# EAGLE design segaaudio (EAGLE 7.7.0)
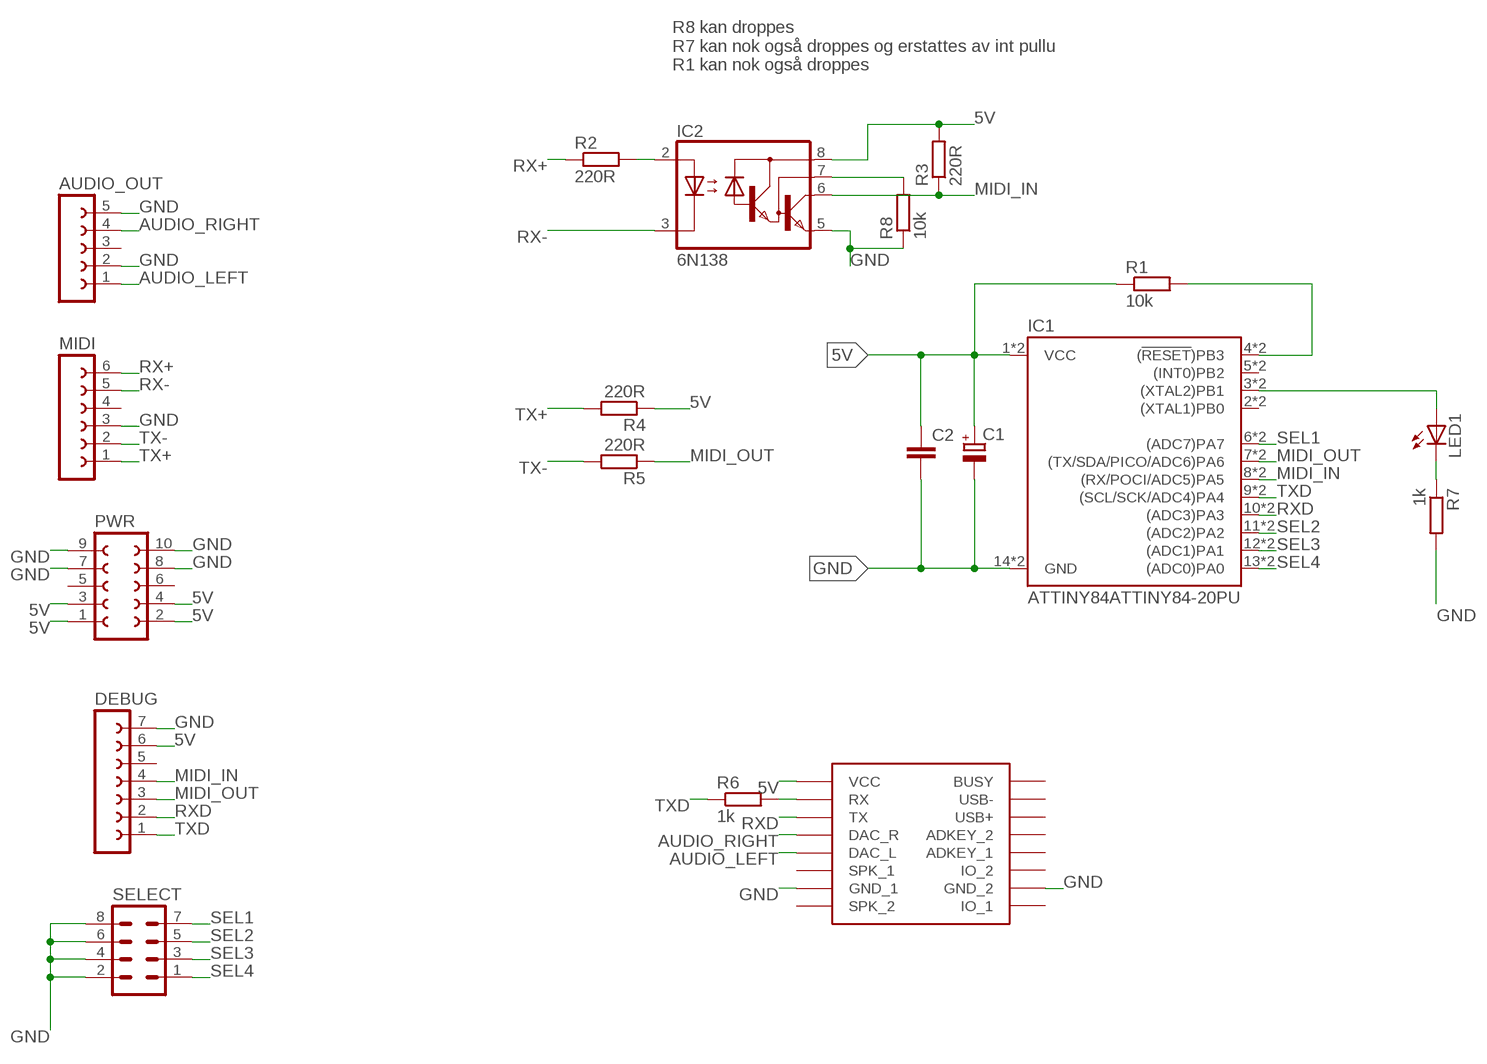
[diagram p0: schematic, sheet 1]

## Parts
AUDIO_OUT  FE05-1  [FE05-1]
C1  CPOL-EUE5-10.5  [E5-10,5]
C2  C-EU050-025X075  [C050-025X075]
DEBUG  FE07-1  [FE07]
IC1  ATTINY84ATTINY84-20PU  [DIP14]
IC2  6N138  [DIL08]
IC3  DFPLAYER  [DFPLAYER]
LED1  LED3MM  [LED3MM]
MIDI  FE06-1  [FE06]
PWR  FE05-2  [FE05-2]
R1  10k  R-EU_0309/12  [0309/12]
R2  220R  R-EU_0309/12  [0309/12]
R3  220R  R-EU_0309/12  [0309/12]
R4  220R  R-EU_0309/12  [0309/12]
R5  220R  R-EU_0309/12  [0309/12]
R6  1k  R-EU_0309/12  [0309/12]
R7  1k  R-EU_0309/12  [0309/12]
R8  10k  R-EU_0309/12  [0309/12]
SELECT  MA04-2  [MA04-2]

## Nets
5V: C1.+ C2.1 DEBUG.6 IC1.1(VCC) IC1.1A(VCC) IC2.8(VCC) IC3.VCC PWR.1 PWR.2 PWR.3 PWR.4 R1.1 R3.2 R4.1
AUDIO_LEFT: AUDIO_OUT.1 IC3.DAC_L
AUDIO_RIGHT: AUDIO_OUT.4 IC3.DAC_R
GND: AUDIO_OUT.2 AUDIO_OUT.5 C1.- C2.2 DEBUG.7 IC1.14(GND) IC1.14A(GND) IC2.5(GND) IC3.GND_1 IC3.GND_2 MIDI.3 PWR.7 PWR.8 PWR.9 PWR.10 R7.2 R8.1 SELECT.2 SELECT.4 SELECT.6 SELECT.8
MIDI_IN: DEBUG.4 IC1.8((RX/POCI/ADC5)PA5) IC1.8A((RX/POCI/ADC5)PA5) IC2.6(VO) R3.1
MIDI_OUT: DEBUG.3 IC1.7((TX/SDA/PICO/ADC6)PA6) IC1.7A((TX/SDA/PICO/ADC6)PA6) R5.1
N$1: IC1.4((!RESET!)PB3) IC1.4A((!RESET!)PB3) R1.2
N$2: IC2.2(A) R2.2
N$3: IC1.3((XTAL2)PB1) IC1.3A((XTAL2)PB1) LED1.A
N$4: LED1.K(C) R7.1
N$5: IC3.RX R6.2
N$6: IC2.7(VB) R8.2
RX+: MIDI.6 R2.1
RX-: IC2.3(C) MIDI.5
RXD: DEBUG.2 IC1.10((ADC3)PA3) IC1.10A((ADC3)PA3) IC3.TX
SEL1: IC1.6((ADC7)PA7) IC1.6A((ADC7)PA7) SELECT.7
SEL2: IC1.11((ADC2)PA2) IC1.11A((ADC2)PA2) SELECT.5
SEL3: IC1.12((ADC1)PA1) IC1.12A((ADC1)PA1) SELECT.3
SEL4: IC1.13((ADC0)PA0) IC1.13A((ADC0)PA0) SELECT.1
TX+: MIDI.1 R4.2
TX-: MIDI.2 R5.2
TXD: DEBUG.1 IC1.9((SCL/SCK/ADC4)PA4) IC1.9A((SCL/SCK/ADC4)PA4) R6.1
Unconnected: AUDIO_OUT.3 DEBUG.5 IC1.2((XTAL1)PB0) IC1.2A((XTAL1)PB0) IC1.5((INT0)PB2) IC1.5A((INT0)PB2) IC3.ADKEY1(ADKEY_1) IC3.ADKEY2(ADKEY_2) IC3.BUSY IC3.IO1(IO_1) IC3.IO2(IO_2) IC3.SPK1(SPK_1) IC3.SPK2(SPK_2) IC3.USB+ IC3.USB- MIDI.4 PWR.5 PWR.6

## Notes on the sheet
- R8 kan droppes
  R7 kan nok også droppes og erstattes av int pullu
  R1 kan nok også droppes

## Library data of the parts
AUDIO_OUT = con-lsta:FE05-1: FEMALE HEADER; OC_FARNELL: unknown; OC_NEWARK: unknown
C1 = rcl:CPOL-EU: POLARIZED CAPACITOR, European symbol
C2 = rcl:C-EU: CAPACITOR, European symbol
DEBUG = con-lsta:FE07-1: FEMALE HEADER; OC_FARNELL: unknown; OC_NEWARK: unknown
IC1 = Ravn-Microcontroller:ATTINY84: Atmel 14-pin 2/4/8kB flash uC Datasheet <https://cdn.sparkfun.com/datasheets/Widgets/doc8006.pdf> SparkFun Products Tiny AVR Programmer <https://www.sparkfun.com/products/11801> (PGM-11801) SparkFun Servo Trigger - Continuous Rotation <https://www.sparkfun.com/products/13872> (WIG-13872) SparkFun Servo Trigger <https://www.sparkfun.com/products/13118> (WIG-13118)
IC2 = optocoupler:6N138: MOTOROLA OPTO COUPLER; MF: VISHAY/TELEFUNKEN; MPN: 6N138; OC_FARNELL: 9860150; OC_NEWARK: 35K5294
IC3 = DFPlayer_v1:DFPLAYER
LED1 = led:LED: LED OSRAM: - CHIPLED LG R971, LG N971, LY N971, LG Q971, LY Q971, LO R971, LY R971 LH N974, LH R974 LS Q976, LO Q976, LY Q976 LO Q996 - Hyper CHIPLED LW Q18S LB Q993, LB Q99A, LB R99A - SideLED LS A670, LO A670, LY A670, LG A670, LP A670 LB A673, LV A673, LT A673, LW A673 LH A674 LY A675 LS A676, LA A676, LO A676, LY A676, LW A676 LS A679, LY A679, LG A679 - Hyper Micro SIDELED® LS Y876, LA Y876, LO Y876, LY Y876 LT Y87S - SmartLED LW L88C, LW L88S LB L89C, LB L89S, LG L890 LS L89K, LO L89K, LY L89K LS L896, LA L896, LO L896, LY L896 - TOPLED LS T670, LO T670, LY T670, LG T670, LP T670 LSG T670, LSP T670, LSY T670, LOP T670, LYG T670 LG T671, LOG T671, LSG T671 LB T673, LV T673, LT T673, LW T673 LH T674 LS T676, LA T676, LO T676, LY T676, LB T676, LH T676, LSB T676, LW T676 LB T67C, LV T67C, LT T67C, LS T67K, LO T67K, LY T67K, LW E67C LS E67B, LA E67B, LO E67B, LY E67B, LB E67C, LV E67C, LT E67C LW T67C LS T679, LY T679, LG T679 LS T770, LO T770, LY T770, LG T770, LP T770 LB T773, LV T773, LT T773, LW T773 LH T774 LS E675, LA E675, LY E675, LS T675 LS T776, LA T776, LO T776, LY T776, LB T776 LHGB T686 LT T68C, LB T68C - Hyper Mini TOPLED® LB M676 - Mini TOPLED Santana® LG M470 LS M47K, LO M47K, LY M47K Source: http://www.osram.convergy.de LUXEON: - LUMILED® LXK2-PW12-R00, LXK2-PW12-S00, LXK2-PW14-U00, LXK2-PW14-V00 LXK2-PM12-R00, LXK2-PM12-S00, LXK2-PM14-U00 LXK2-PE12-Q00, LXK2-PE12-R00, LXK2-PE12-S00, LXK2-PE14-T00, LXK2-PE14-U00 LXK2-PB12-K00, LXK2-PB12-L00, LXK2-PB12-M00, LXK2-PB14-N00, LXK2-PB14-P00, LXK2-PB14-Q00 LXK2-PR12-L00, LXK2-PR12-M00, LXK2-PR14-Q00, LXK2-PR14-R00 LXK2-PD12-Q00, LXK2-PD12-R00, LXK2-PD12-S00 LXK2-PH12-R00, LXK2-PH12-S00 LXK2-PL12-P00, LXK2-PL12-Q00, LXK2-PL12-R00 Source: www.luxeon.com KINGBRIGHT: KA-3528ASYC Source: www.kingbright.com
MIDI = con-lsta:FE06-1: FEMALE HEADER; OC_FARNELL: unknown; OC_NEWARK: unknown
PWR = con-lsta:FE05-2: FEMALE HEADER; OC_FARNELL: unknown; OC_NEWARK: unknown
R1-R8 = rcl:R-EU_: RESISTOR, European symbol
SELECT = con-lstb:MA04-2: PIN HEADER; OC_FARNELL: unknown; OC_NEWARK: unknown

## Net classes
0 default: width 0.203 mm

## Board
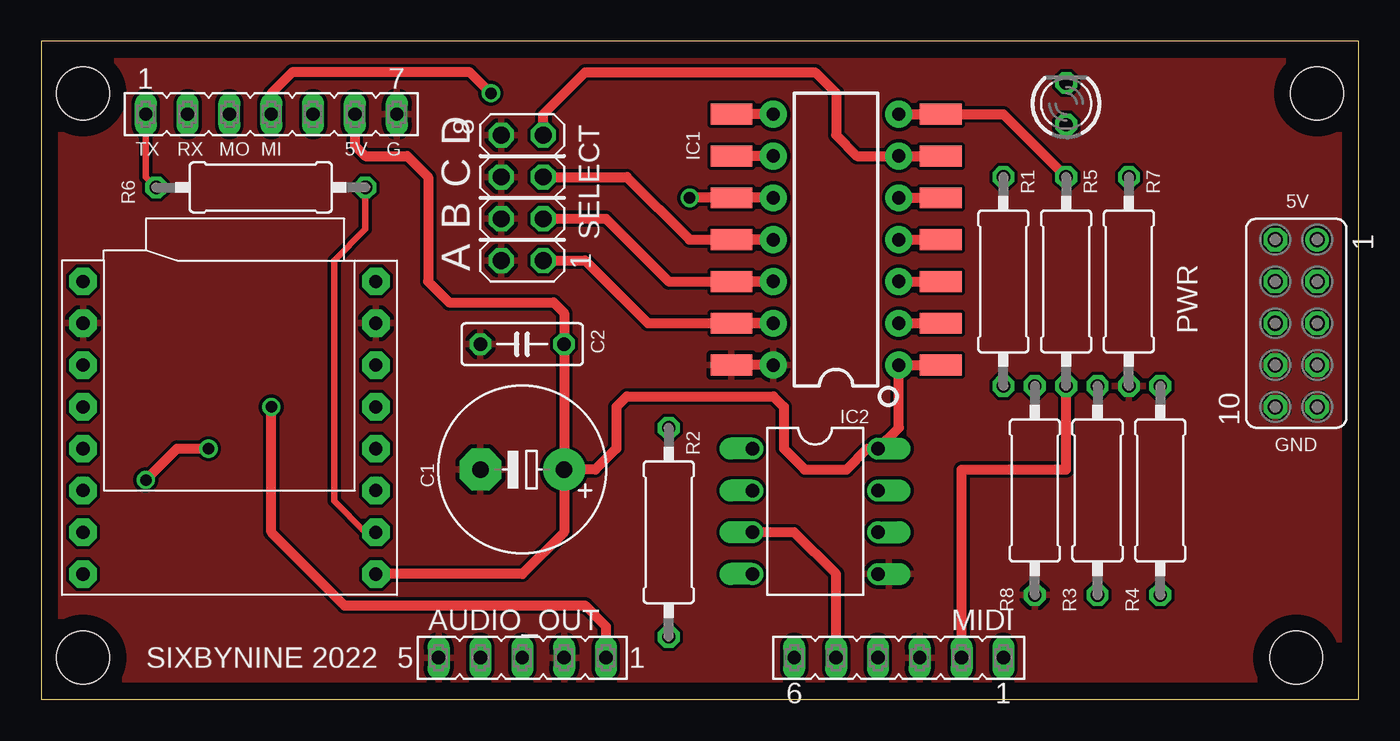
[diagram p1: board, top side]
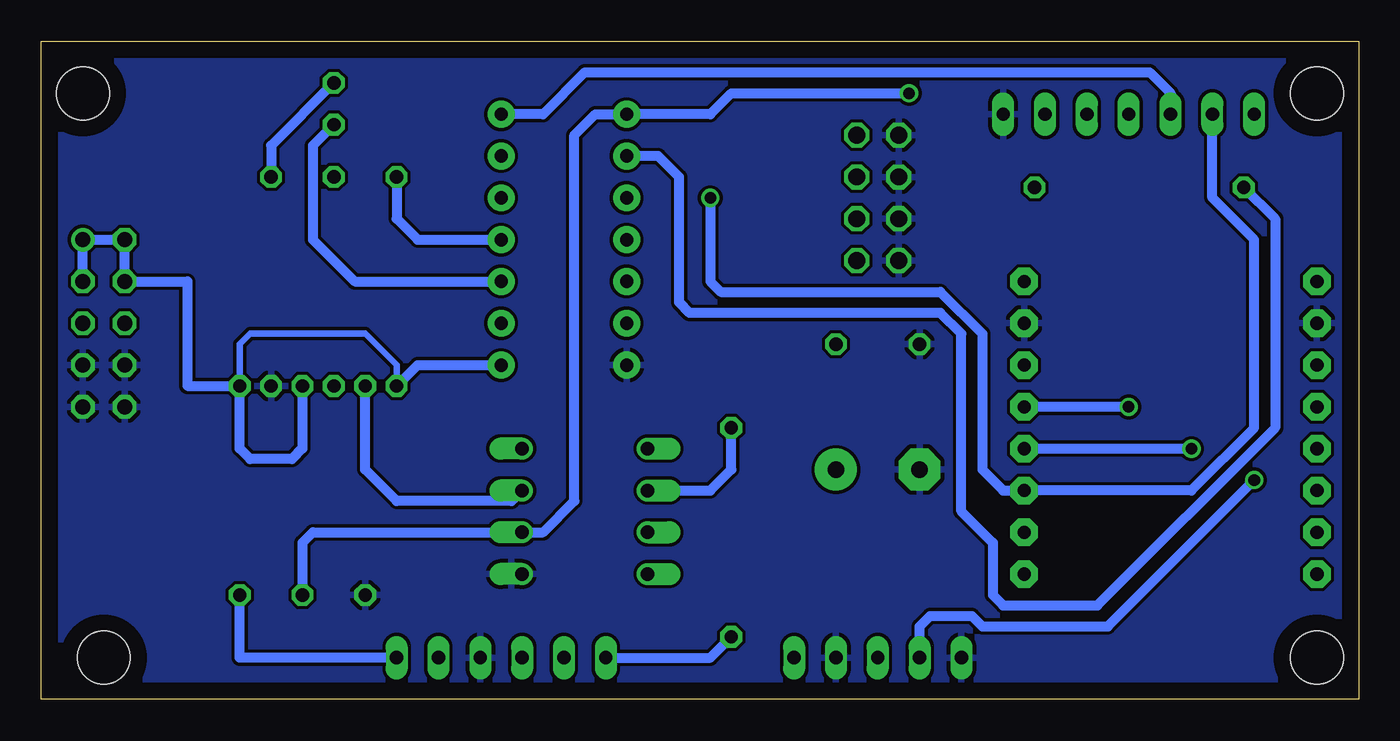
[diagram p2: board, bottom side, seen from below]

Size 80 x 40 mm. Coordinates in mm from the lower left corner, seen from the top.
Outline: 0,0 80,0 80,40 0,40 0,0
Copper layers (1*16): Top 0.035mm / dielectric 1.5mm / Bottom 0.035mm
Design rules "default": minimum track width 10mil, minimum drill 24mil, track to track 8mil, track to pad 8mil, pad to pad 8mil, via to via 8mil, smd to smd 8mil, copper to edge 40mil, drill to drill 8mil, minimum pad ring 10mil, minimum via ring 8mil, stop-mask expansion 4mil, vias tented up to drill 0mil, thermal gap 10mil
Holes 3.2 mm at 2.54,36.83 77.47,36.83 76.2,2.54 2.54,2.54

### Footprints (pad centres in the part's own frame; a part is rotated, then mirrored left to right if it is on the bottom)
FE05-1 = drill 0.813 long: 1 -5.08,0; 2 -2.54,0; 3 0,0; 4 2.54,0; 5 5.08,0
E5-10,5 = drill 1.016 pad 2.54: + -2.54,0 | drill 1.016 pad 2.54 octagon: - 2.54,0
C050-025X075 = drill 0.813 octagon: 1 -2.54,0; 2 2.54,0
FE07 = drill 0.813 long: 1 -7.62,0; 2 -5.08,0; 3 -2.54,0; 4 0,0; 5 2.54,0; 6 5.08,0; 7 7.62,0
DIP14 = drill 0.813 pad 1.626: 1 -7.62,-3.81; 2 -5.08,-3.81; 3 -2.54,-3.81; 4 0,-3.81; 5 2.54,-3.81; 6 5.08,-3.81; 7 7.62,-3.81; 8 7.62,3.81; 9 5.08,3.81; 10 2.54,3.81; 11 0,3.81; 12 -2.54,3.81; 13 -5.08,3.81; 14 -7.62,3.81 | smd 1.27 x 2.54: 1A -7.62,-6.35; 2A -5.08,-6.35; 3A -2.54,-6.35; 4A 0,-6.35; 5A 2.54,-6.35; 6A 5.08,-6.35; 7A 7.62,-6.35; 8A 7.62,6.35; 9A 5.08,6.35; 10A 2.54,6.35; 11A 0,6.35; 12A -2.54,6.35; 13A -5.08,6.35; 14A -7.62,6.35
DIL08 = drill 0.813 offset: 1 -3.81,-3.81; 2 -1.27,-3.81; 3 1.27,-3.81; 4 3.81,-3.81; 5 3.81,3.81; 6 1.27,3.81; 7 -1.27,3.81; 8 -3.81,3.81
DFPLAYER = drill 0.8 pad 1.676 octagon: ADKEY1 8.89,-1.27; ADKEY2 8.89,1.27; BUSY 8.89,8.89; DAC_L -8.89,-1.27; DAC_R -8.89,1.27; GND_1 -8.89,-6.35; GND_2 8.89,-6.35; IO1 8.89,-8.89; IO2 8.89,-3.81; RX -8.89,6.35; SPK1 -8.89,-3.81; SPK2 -8.89,-8.89; TX -8.89,3.81; USB+ 8.89,3.81; USB- 8.89,6.35; VCC -8.89,8.89
LED3MM = drill 0.813 octagon: A -1.27,0; K 1.27,0
FE06 = drill 0.813 long: 1 -6.35,0; 2 -3.81,0; 3 -1.27,0; 4 1.27,0; 5 3.81,0; 6 6.35,0
FE05-2 = drill 0.914: 1 -5.08,1.27 | drill 0.914 octagon: 2 -5.08,-1.27; 3 -2.54,1.27; 4 -2.54,-1.27; 5 0,1.27; 6 0,-1.27; 7 2.54,1.27; 8 2.54,-1.27; 9 5.08,1.27; 10 5.08,-1.27
0309/12 = drill 0.813 octagon: 1 -6.35,0; 2 6.35,0
MA04-2 = drill 1.016 octagon: 1 -3.81,-1.27; 2 -3.81,1.27; 3 -1.27,-1.27; 4 -1.27,1.27; 5 1.27,-1.27; 6 1.27,1.27; 7 3.81,-1.27; 8 3.81,1.27

### Placement (x,y rotation side)
AUDIO_OUT  29.21,2.54 180 top
C1  29.21,13.97 180 top
C2  29.21,21.59 180 top
DEBUG  13.97,35.56 0 top
IC1  48.26,27.94 90 top
IC2  46.99,11.43 270 top
IC3  11.43,16.51 180 top
LED1  62.23,36.2 90 top
MIDI  52.07,2.54 180 top
PWR  76.2,22.86 270 top
R1  58.42,25.4 90 top
R2  38.1,10.16 90 top
R3  64.14,12.7 90 top
R4  67.94,12.7 270 top
R5  62.23,25.4 270 top
R6  13.34,31.11 0 top
R7  66.04,25.4 270 top
R8  60.33,12.7 90 top
SELECT  29.21,30.48 90 top

### Tracks (layer width: path | path; a pad name or v marks a point on that pad's centre or on a via)
5V
  Top 0.61: C1.+ C2.1 31.75,23.5 31.11,24.13 24.77,24.13 23.5,25.4 23.5,31.75 22.23,33.02 19.68,33.02 19.05,33.66 DEBUG.6 | C1.+ 33.66,13.97 34.92,15.24 34.92,17.78 35.56,18.41 44.45,18.41 45.09,17.78 45.09,15.24 46.35,13.97 48.9,13.97 50.16,15.24 IC2.8 52.07,16.51 IC1.1 | C1.+ 31.75,10.16 29.21,7.62 IC3.VCC
  Bottom 0.406: R4.1 67.94,21.59 67.31,22.23 60.33,22.23 58.42,20.32 R1.1
  Bottom 0.61: R1.1 57.15,20.32 IC1.1 | R3.2 64.14,15.24 64.77,14.61 67.31,14.61 67.94,15.24 R4.1 71.12,19.05 71.12,25.4 PWR.4 PWR.2 PWR.1 PWR.3
AUDIO_LEFT  (via drill 0.7)
  Top 0.61: v13.97,17.78 13.97,10.16 18.41,5.71 33.02,5.71 34.29,4.45 AUDIO_OUT.1
  Bottom 0.61: v13.97,17.78 IC3.DAC_L
AUDIO_RIGHT  (via drill 0.7)
  Top 0.61: v6.35,13.34 8.26,15.24 v10.16,15.24
  Bottom 0.61: IC3.DAC_R v10.16,15.24 | AUDIO_OUT.4 26.67,4.45 26.04,5.08 23.5,5.08 22.86,4.45 15.24,4.45 v6.35,13.34
GND
  pour Bottom: 0,41.91 91.44,41.91 91.44,-2.54 0,-2.54
  pour Top: -1.27,40.64 83.82,40.64 83.82,-1.27 -1.27,-1.27
MIDI_IN  (via drill 0.7)
  Top 0.61: v27.3,36.83 26.04,38.1 15.24,38.1 13.97,36.83 DEBUG.4
  Bottom 0.61: v27.3,36.83 38.1,36.83 39.37,35.56 IC1.8 46.35,35.56 47.62,34.29 47.62,12.06 49.53,10.16 IC2.6 63.5,10.16 64.14,9.53 R3.1
MIDI_OUT
  Top 0.61: IC1.7A 58.42,35.56 R5.1
  Bottom 0.61: IC1.7 49.53,35.56 46.99,38.1 12.7,38.1 11.43,36.83 DEBUG.3
N$1
  Bottom 0.61: R1.2 58.42,29.21 57.15,27.94 IC1.4
N$2
  Bottom 0.61: IC2.2 39.37,12.7 38.1,13.97 R2.2
N$3
  Bottom 0.61: LED1.A 63.5,33.66 63.5,27.94 60.96,25.4 IC1.3
N$4
  Bottom 0.61: LED1.K 66.04,33.66 R7.1
N$5
  Top 0.406: R6.2 19.68,28.57 17.78,26.67 17.78,12.06 19.68,10.16 IC3.RX
N$6
  Bottom 0.61: IC2.7 51.44,12.06 58.42,12.06 60.33,13.97 R8.2
RX+
  Bottom 0.61: MIDI.6 39.37,2.54 R2.1
RX-
  Top 0.61: MIDI.5 48.26,7.62 45.72,10.16 IC2.3
RXD  (via drill 0.7)
  Top 0.61: IC1.10A v39.37,30.48
  Bottom 0.61: v39.37,30.48 39.37,25.4 38.73,24.77 25.4,24.77 22.86,22.23 22.86,13.97 21.59,12.7 IC3.TX 10.16,12.7 6.35,16.51 6.35,27.94 8.89,30.48 DEBUG.2
SEL1
  Top 0.61: SELECT.7 30.48,35.56 33.02,38.1 46.99,38.1 48.26,36.83 48.26,34.29 49.53,33.02 IC1.6
SEL2
  Top 0.61: SELECT.5 35.56,31.75 39.37,27.94 IC1.11
SEL3
  Top 0.61: SELECT.3 34.29,29.21 38.1,25.4 IC1.12
SEL4
  Top 0.61: SELECT.1 33.02,26.67 36.83,22.86 IC1.13
TX+
  Bottom 0.61: MIDI.1 67.94,2.54 R4.2
TX-
  Top 0.61: MIDI.2 55.88,13.97 62.23,13.97 R5.2
TXD
  Top 0.406: R6.1 6.35,31.75 DEBUG.1
  Bottom 0.61: IC1.9 42.55,33.02 41.27,31.75 41.27,24.13 40.64,23.5 25.4,23.5 24.13,22.23 24.13,11.43 22.23,9.53 22.23,6.35 21.59,5.71 15.88,5.71 5.08,16.51 5.08,29.21 R6.1

### Text on the board
tPlace: D | TX | RX | MO | MI | 5V | G | C | 5V | B | A | GND | SIXBYNINE 2022